# EAGLE design dongle (EAGLE 6.5.0)

## Sheet 1 of 2
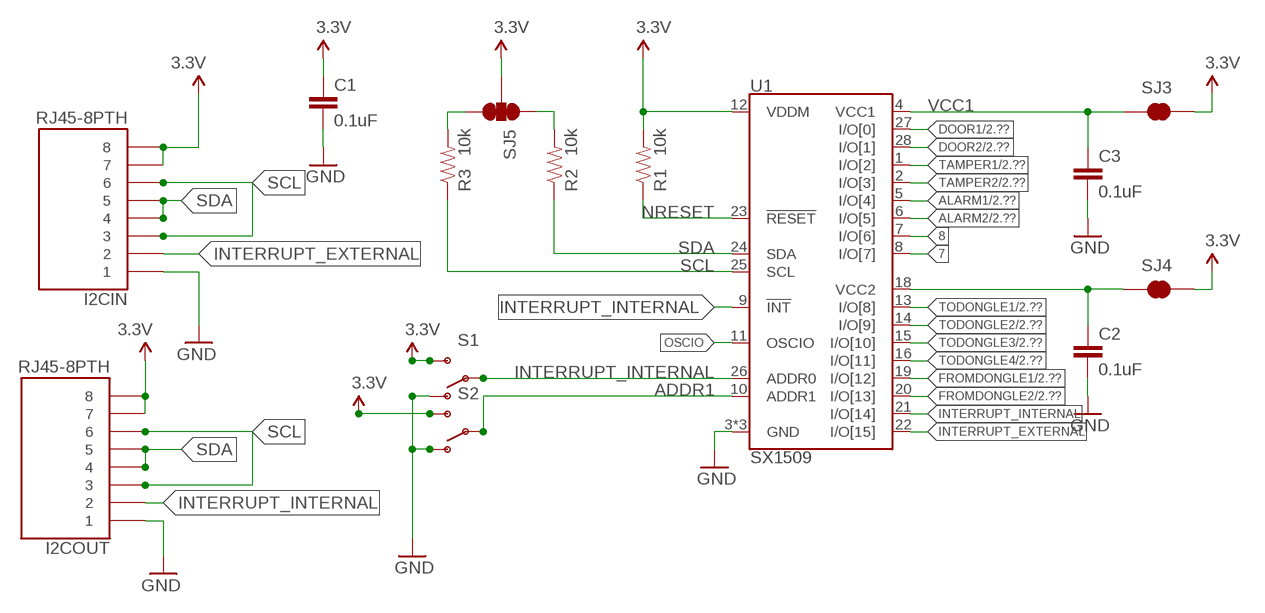
[diagram p0: schematic, sheet 1]

### Parts
C1  0.1uF  CAP0402-CAP  [0402-CAP]
C2  0.1uF  CAP0402-CAP  [0402-CAP]
C3  0.1uF  CAP0402-CAP  [0402-CAP]
I2CIN  RJ45-8PTH  [RJ45-8]
I2COUT  RJ45-8PTH  [RJ45-8]
R1  10k  RESISTOR0402-RES  [0402-RES]
R2  10k  RESISTOR0402-RES  [0402-RES]
R3  10k  RESISTOR0402-RES  [0402-RES]
S1  SWITCH-SPDT-SMD-A  [SWITCH-SPST-SMD-A]
S2  SWITCH-SPDT-SMD-A  [SWITCH-SPST-SMD-A]
SJ3  SOLDERJUMPERNO  [SJ_2S-NO]
SJ4  SOLDERJUMPERNO  [SJ_2S-NO]
SJ5  SOLDERJUMPER_2WAYS  [SJ_3]
U1  SX1509  [QFN-28]

### Nets
3.3V: C1.1 I2CIN.7 I2CIN.8 I2COUT.7 I2COUT.8 R1.2 S1.3(S) S2.3(S) SJ3.2 SJ4.2 SJ5.2 U1.12(VDDM) ; also sheet 2
7: U1.8(I/O[7])
8: U1.7(I/O[6])
ADDR1: S2.2(P) U1.10(ADDR1)
ALARM1: U1.5(I/O[4]) ; also sheet 2
ALARM2: U1.6(I/O[5]) ; also sheet 2
DOOR1: U1.27(I/O[0]) ; also sheet 2
DOOR2: U1.28(I/O[1]) ; also sheet 2
FROMDONGLE1: U1.19(I/O[12]) ; also sheet 2
FROMDONGLE2: U1.20(I/O[13]) ; also sheet 2
GND: C1.2 C2.2 C3.2 I2CIN.1 I2COUT.1 S1.1(O) S2.1(O) U1.3(GND) U1.17(GND) U1.29(GND) ; also sheet 2
INTERRUPT_EXTERNAL: I2CIN.2 U1.22(I/O[15])
INTERRUPT_INTERNAL: I2COUT.2 S1.2(P) U1.9(!INT) U1.21(I/O[14]) U1.26(ADDR0)
N$1: R3.2 SJ5.3
N$2: R2.2 SJ5.1
NRESET: R1.1 U1.23(!RESET)
OSCIO: U1.11(OSCIO)
SCL: I2CIN.3 I2CIN.6 I2COUT.3 I2COUT.6 R3.1 U1.25(SCL)
SDA: I2CIN.4 I2CIN.5 I2COUT.4 I2COUT.5 R2.1 U1.24(SDA)
TAMPER1: U1.1(I/O[2]) ; also sheet 2
TAMPER2: U1.2(I/O[3]) ; also sheet 2
TODONGLE1: U1.13(I/O[8]) ; also sheet 2
TODONGLE2: U1.14(I/O[9]) ; also sheet 2
TODONGLE3: U1.15(I/O[10]) ; also sheet 2
TODONGLE4: U1.16(I/O[11]) ; also sheet 2
VCC1: C3.1 SJ3.1 U1.4(VCC1)
VCC2: C2.1 SJ4.1 U1.18(VCC2)

## Sheet 2 of 2
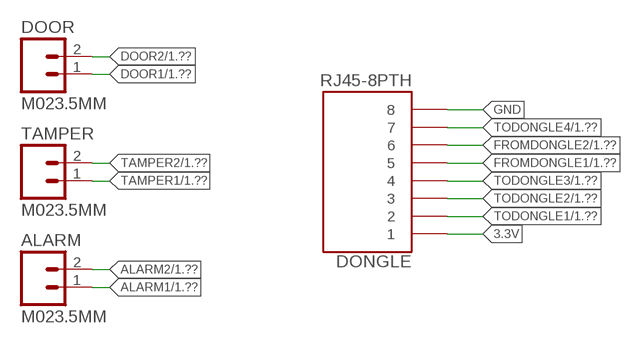
[diagram p1: schematic, sheet 2]

### Parts
ALARM  M023.5MM  [SCREWTERMINAL-3.5MM-2]
DONGLE  RJ45-8PTH  [RJ45-8]
DOOR  M023.5MM  [SCREWTERMINAL-3.5MM-2]
TAMPER  M023.5MM  [SCREWTERMINAL-3.5MM-2]

### Nets
3.3V: DONGLE.1 ; also sheet 1
ALARM1: ALARM.1 ; also sheet 1
ALARM2: ALARM.2 ; also sheet 1
DOOR1: DOOR.1 ; also sheet 1
DOOR2: DOOR.2 ; also sheet 1
FROMDONGLE1: DONGLE.5 ; also sheet 1
FROMDONGLE2: DONGLE.6 ; also sheet 1
GND: DONGLE.8 ; also sheet 1
TAMPER1: TAMPER.1 ; also sheet 1
TAMPER2: TAMPER.2 ; also sheet 1
TODONGLE1: DONGLE.2 ; also sheet 1
TODONGLE2: DONGLE.3 ; also sheet 1
TODONGLE3: DONGLE.4 ; also sheet 1
TODONGLE4: DONGLE.7 ; also sheet 1

## Library data of the parts
ALARM DOOR TAMPER = SparkFun-Connectors:M02: Standard 2-pin 0.1" header. Use with - straight break away headers ( PRT-00116) - right angle break away headers (PRT-00553) - swiss pins (PRT-00743) - machine pins (PRT-00117) - female headers (PRT-00115) Molex polarized connector foot print use with: PRT-08233 with associated crimp pins and housings. 2.54_SCREWTERM for use with PRT-10571. 3.5mm Screw Terminal footprints for PRT-08084 5mm Screw Terminal footprints for use with PRT-08433
C1-C3 = SparkFun-Passives:CAP: Capacitor Standard 0603 ceramic capacitor, and 0.1" leaded capacitor.
DONGLE I2CIN I2COUT = SparkFun-Connectors:RJ45-8: RJ45 Jack Simple RJ45, 8-pin connection - connector for common Cat5, Cat5e, and Cat6 Ethernet cables. Footprint not yet proven in production. Connector sku is PRT-00643; Breakout PCB sku is BOB-00716.
R1-R3 = SparkFun-Passives:RESISTOR: Resistor Basic schematic elements and footprints for 0603, 1206, and PTH resistors.
S1 S2 = SparkFun-Electromechanical:SWITCH-SPDT: SPDT Switch Simple slide switch, Spark Fun Electronics SKU : COM-00102 DPDT SMT slide switch, AYZ0202, SWCH-08179
SJ3 SJ4 = SparkFun-Passives:SOLDERJUMPER: Solder Jumper Standard SMD solder jumper. Used to automate production. Two varients : Normally Open and Normally Closed are the same, but have different paste layers. NC will have a large amount of paste and should jumper during reflow.
SJ5 = SparkFun-Passives:SOLDERJUMPER_2WAY: Solder Jumper 2 way solder jumper
U1 = SparkFun-DigitalIC:SX1509

## Board
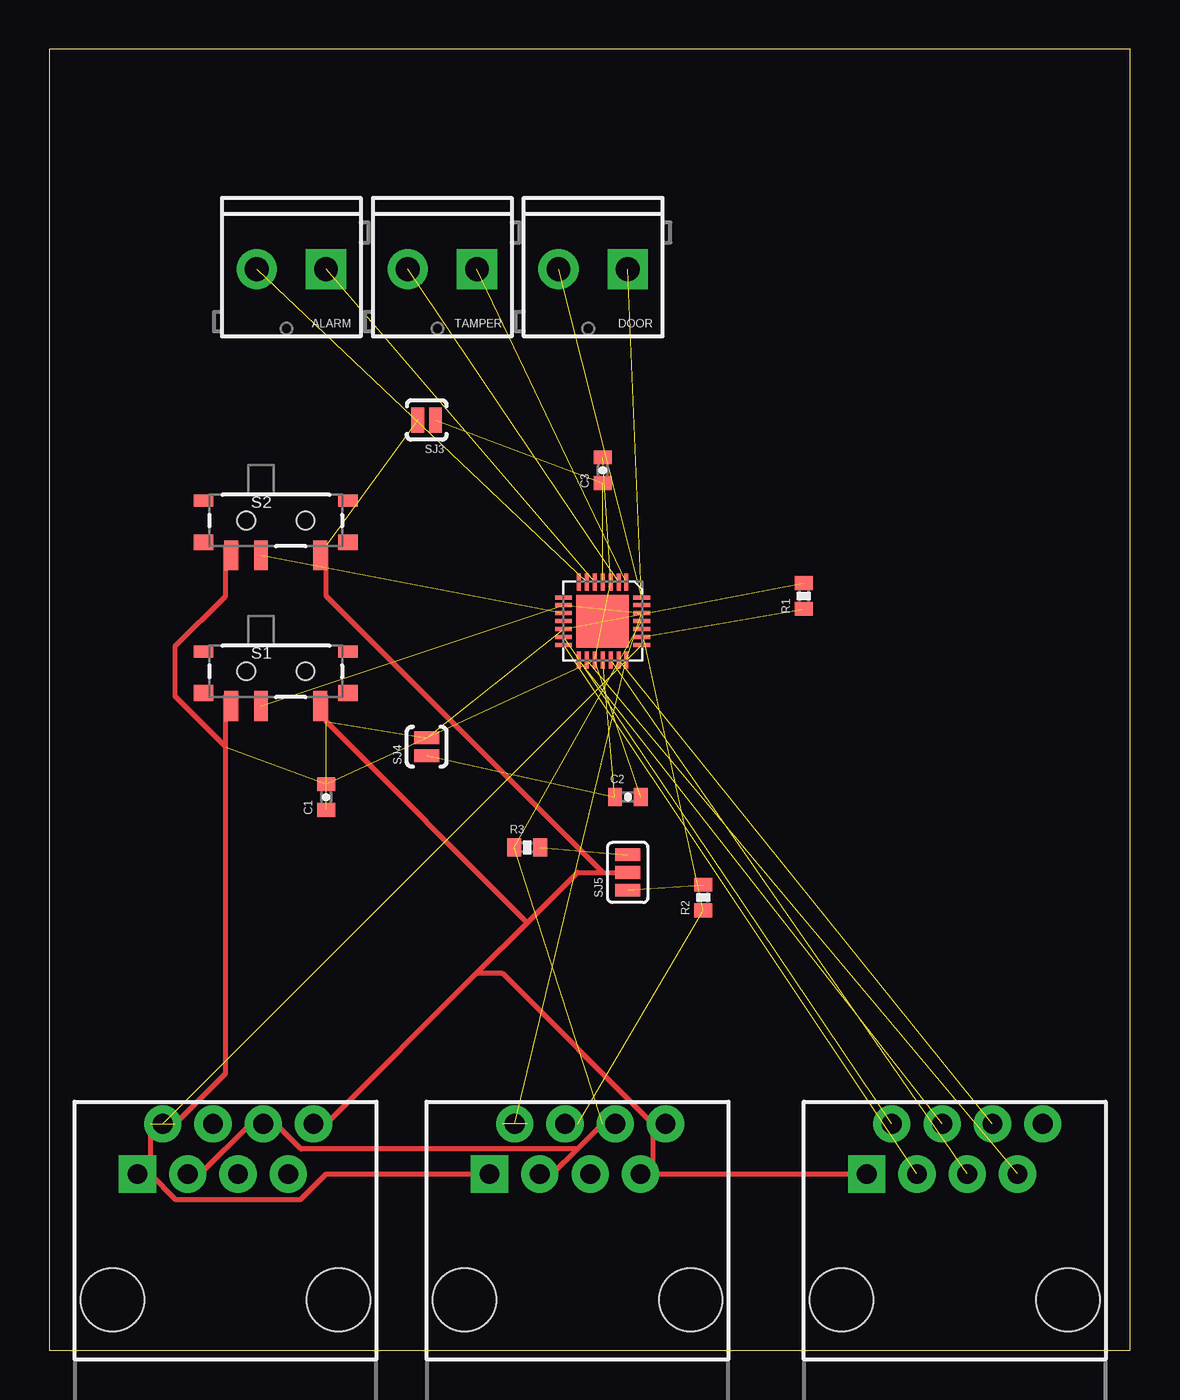
[diagram p2: board, top side]
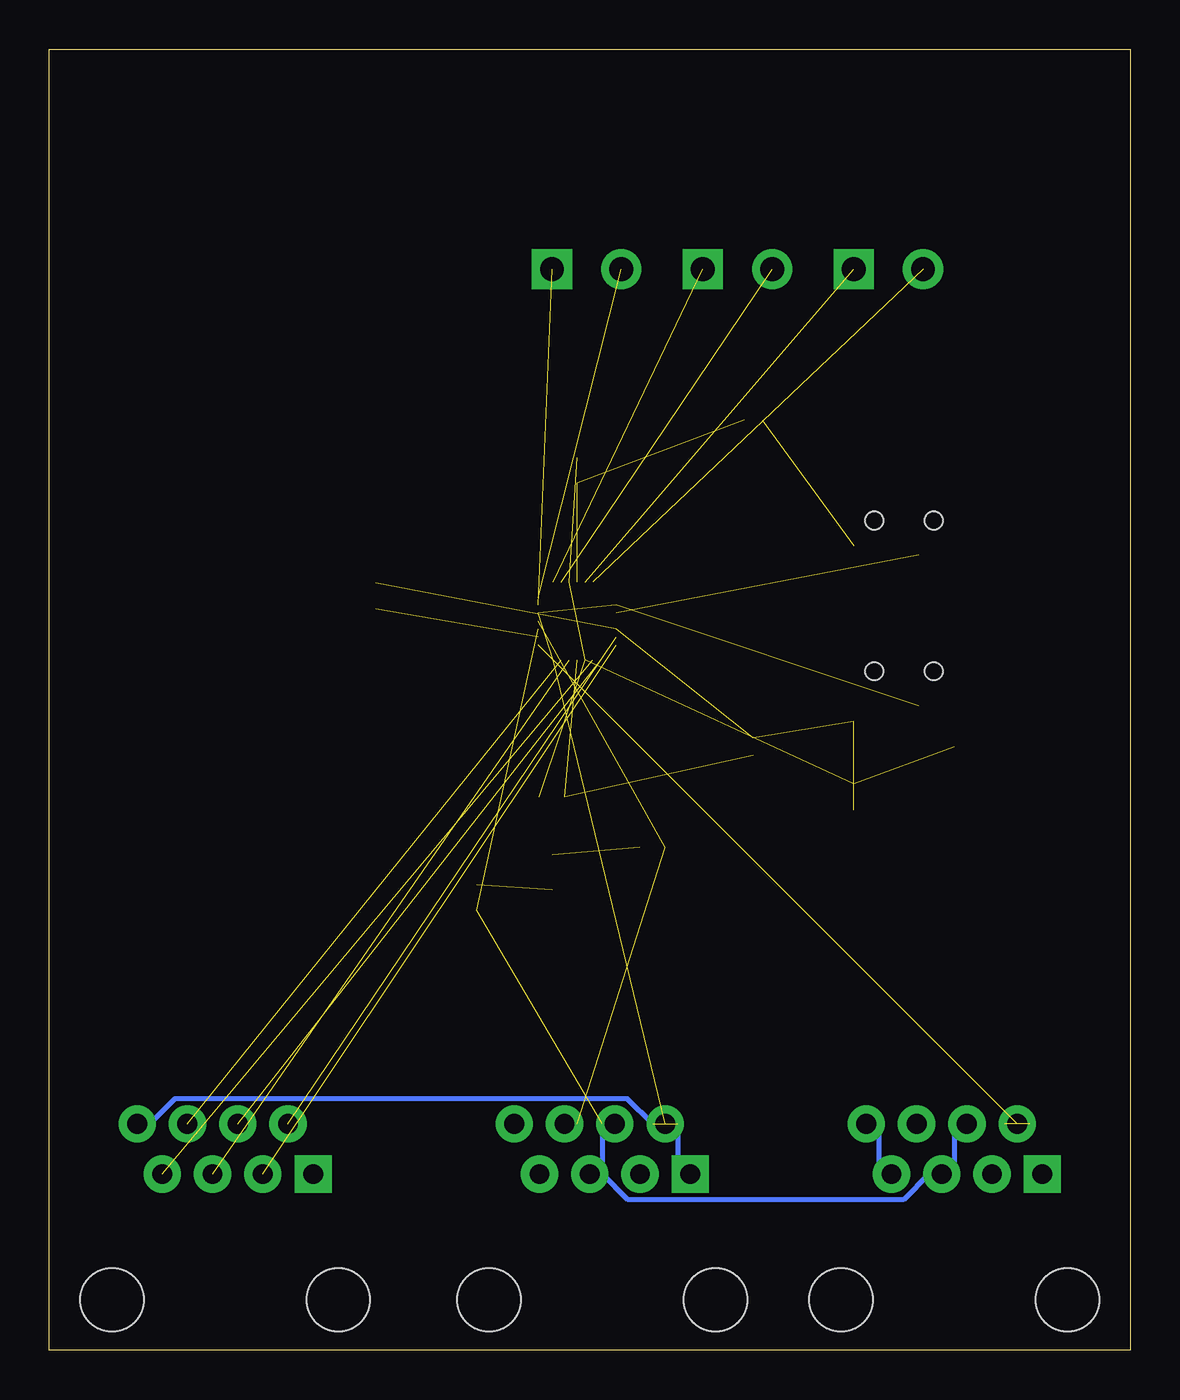
[diagram p3: board, bottom side, seen from below]

Size 54.59 x 65.71 mm. Coordinates in mm from the lower left corner, seen from the top.
Outline: 0,0 54.59,0 54.59,65.71 0,65.71 0,0
Copper layers (1*16): Top 0.035mm / dielectric 1.5mm / Bottom 0.035mm
Design rules "default": minimum track width 10mil, minimum drill 24mil, track to track 8mil, track to pad 8mil, pad to pad 8mil, via to via 8mil, smd to smd 8mil, copper to edge 40mil, drill to drill 8mil, minimum pad ring 10mil, minimum via ring 8mil, stop-mask expansion 4mil, vias tented up to drill 0mil, thermal gap 10mil

### Footprints (pad centres in the part's own frame; a part is rotated, then mirrored left to right if it is on the bottom)
SCREWTERMINAL-3.5MM-2 = drill 1.2 pad 2.032 square: 1 0,0 | drill 1.2 pad 2.032: 2 3.5,0
0402-CAP = smd 0.7 x 0.9: 1 -0.65,0; 2 0.65,0
RJ45-8 = drill 1 pad 1.88 square: 1 -4.445,6.35 | drill 1 pad 1.88: 2 -3.175,8.89; 3 -1.905,6.35; 4 -0.635,8.89; 5 0.635,6.35; 6 1.905,8.89; 7 3.175,6.35; 8 4.445,8.89 | hole 3.2: -5.715,0; 5.715,0
0402-RES = smd 0.7 x 0.9: 1 -0.65,0; 2 0.65,0
SWITCH-SPST-SMD-A = smd 0.7 x 1.5: 1 -2.25,-1.75; 2 -0.75,-1.75; 3 2.25,-1.75 | smd 1 x 0.6: GND1 -3.65,1; GND3 3.65,1 | smd 1 x 0.8: GND2 -3.65,-1.1; GND4 3.65,-1.1 | hole 0.9: -1.5,0; 1.5,0
SJ_2S-NO = smd 0.635 x 1.27: 1 -0.45,0; 2 0.45,0
SJ_3 = smd 0.635 x 1.27: 1 -0.889,0; 2 0,0; 3 0.889,0
QFN-28 = smd 0.85 x 0.2: 1 -1.975,1.2; 2 -1.975,0.8; 3 -1.975,0.4; 4 -1.975,0; 5 -1.975,-0.4; 6 -1.975,-0.8; 7 -1.975,-1.2; 15 1.975,-1.2; 16 1.975,-0.8; 17 1.975,-0.4; 18 1.975,0; 19 1.975,0.4; 20 1.975,0.8; 21 1.975,1.2 | smd 0.2 x 0.85: 8 -1.2,-1.975; 9 -0.8,-1.975; 10 -0.4,-1.975; 11 0,-1.975; 12 0.4,-1.975; 13 0.8,-1.975; 14 1.2,-1.975; 22 1.2,1.975; 23 0.8,1.975; 24 0.4,1.975; 25 0,1.975; 26 -0.4,1.975; 27 -0.8,1.975; 28 -1.2,1.975 | smd 2.65 x 2.65: 29 0,0

### Placement (x,y rotation side)
ALARM  13.97,54.61 180 top
C1  13.97,27.94 90 top
C2  29.21,27.94 0 top
C3  27.94,44.45 90 top
DONGLE  45.72,2.54 0 top
DOOR  29.21,54.61 180 top
I2CIN  8.89,2.54 0 top
I2COUT  26.67,2.54 0 top
R1  38.1,38.1 90 top
R2  33.02,22.86 90 top
R3  24.13,25.4 0 top
S1  11.43,34.29 0 top
S2  11.43,41.91 0 top
SJ3  19.05,46.99 180 top
SJ4  19.05,30.48 90 top
SJ5  29.21,24.13 90 top
TAMPER  21.59,54.61 180 top
U1  27.94,36.83 270 top

### Tracks (layer width: path | path; a pad name or v marks a point on that pad's centre or on a via)
3.3V  (5 unrouted)
  Top 0.254: 30.48,11.43 30.48,8.89 | 30.48,8.89 DONGLE.1 | 30.48,8.89 I2COUT.7 | 27.94,24.13 26.67,24.13 24.13,21.59 | 27.94,24.13 SJ5.2 | 21.59,19.05 13.97,11.43 I2CIN.8 | 21.59,19.05 24.13,21.59 | 24.13,21.59 13.97,31.75 13.97,33.02 S1.3 | 27.94,24.13 13.97,38.1 13.97,40.64 S2.3 | 30.48,11.43 22.86,19.05 21.59,19.05 | 30.48,11.43 I2COUT.8
  Bottom 0.254: I2CIN.7 12.7,8.89 12.7,11.43 I2CIN.8
ADDR1  (1 unrouted)
ALARM1  (1 unrouted)
ALARM2  (1 unrouted)
DOOR1  (1 unrouted)
DOOR2  (1 unrouted)
FROMDONGLE1  (1 unrouted)
FROMDONGLE2  (1 unrouted)
GND  (8 unrouted)
  Top 0.254: 8.89,30.48 8.89,13.97 6.35,11.43 | 8.89,30.48 8.89,33.02 S1.1 | 8.89,30.48 6.35,33.02 6.35,35.56 8.89,38.1 8.89,40.64 S2.1 | 5.08,11.43 5.08,8.89 | I2COUT.1 13.97,8.89 12.7,7.62 6.35,7.62 5.08,8.89 | 5.08,8.89 I2CIN.1
  Bottom 0.254: 22.86,11.43 22.86,8.89 I2COUT.1 | 24.13,11.43 25.4,12.7 48.26,12.7 49.53,11.43 DONGLE.8
INTERRUPT_EXTERNAL  (1 unrouted)
INTERRUPT_INTERNAL  (4 unrouted)
N$1  (1 unrouted)
N$2  (1 unrouted)
NRESET  (1 unrouted)
SCL  (2 unrouted)
  Top 0.254: I2CIN.3 7.62,8.89 10.16,11.43 I2CIN.6 11.43,11.43 12.7,10.16 26.67,10.16 | 26.67,10.16 27.94,11.43 I2COUT.6 | 26.67,10.16 25.4,8.89 I2COUT.3
SDA  (2 unrouted)
  Bottom 0.254: I2CIN.4 8.89,11.43 8.89,8.89 I2CIN.5 10.16,8.89 11.43,7.62 25.4,7.62 26.67,8.89 | 26.67,8.89 26.67,11.43 I2COUT.4 | 26.67,8.89 I2COUT.5
TAMPER1  (1 unrouted)
TAMPER2  (1 unrouted)
TODONGLE1  (1 unrouted)
TODONGLE2  (1 unrouted)
TODONGLE3  (1 unrouted)
TODONGLE4  (1 unrouted)
VCC1  (2 unrouted)
VCC2  (2 unrouted)